# Altium schematic sheet Copy of -5V Buck and Power Jack.SchDoc
size A; SheetNumber: 3; SheetTotal: 7
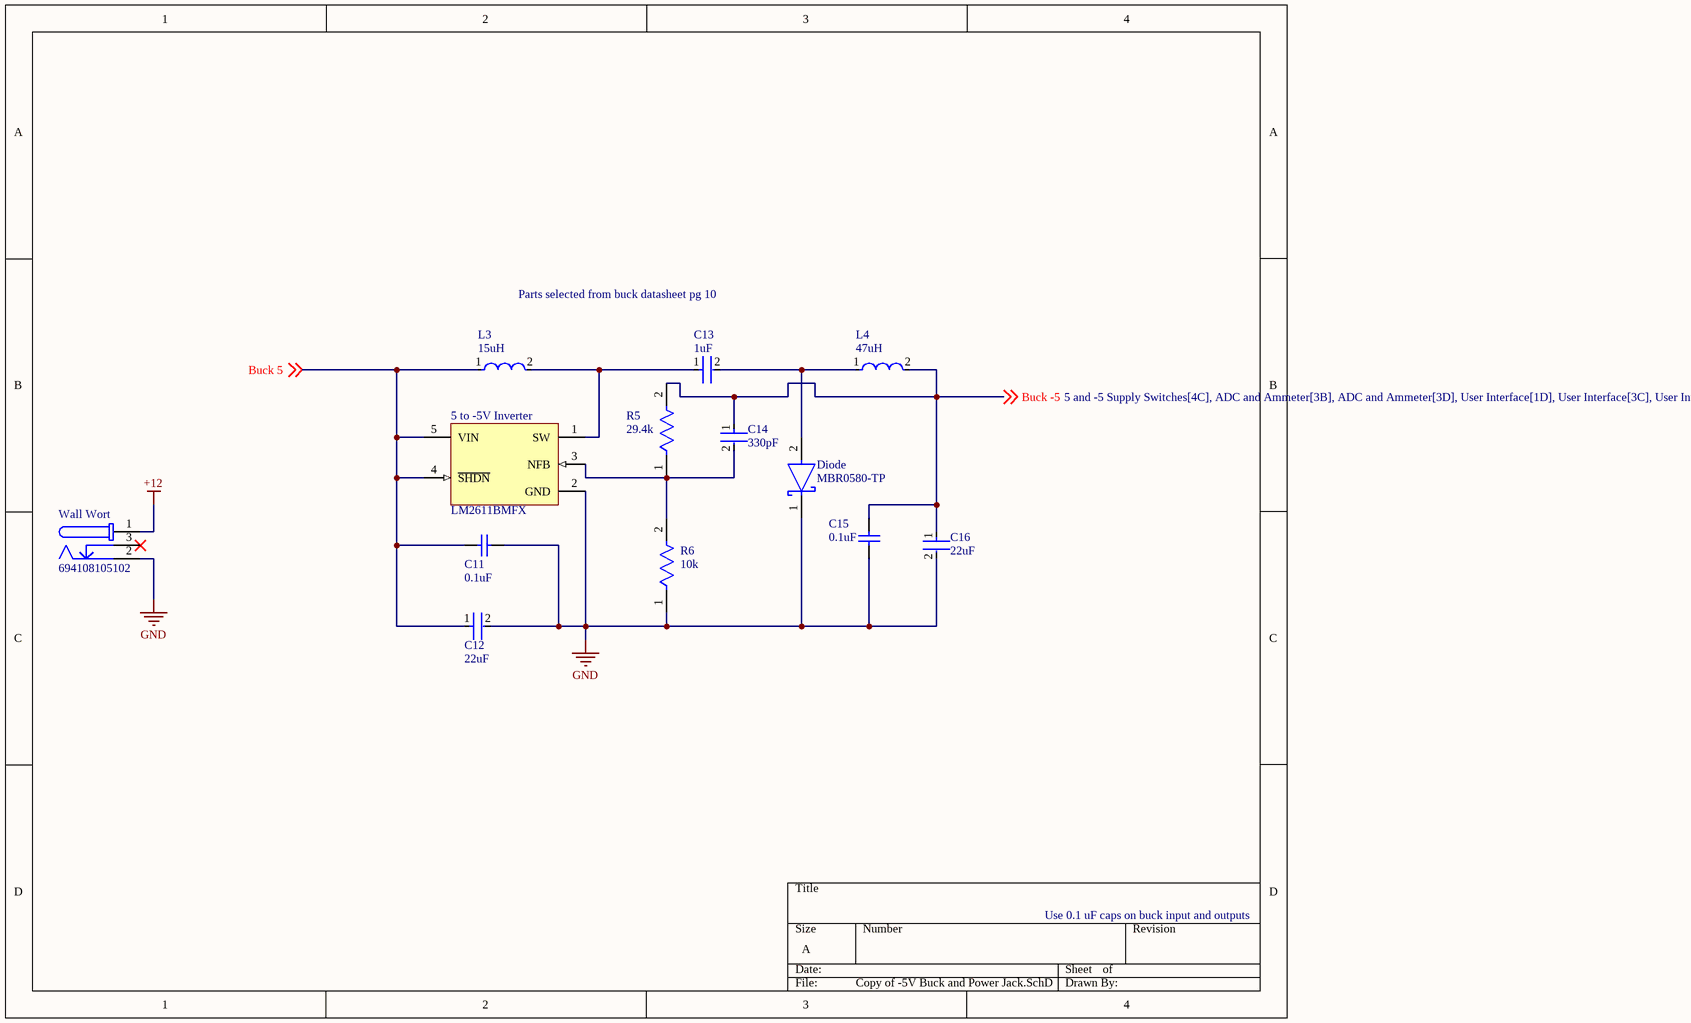
[diagram p0: Copy of -5V Buck and Power Jack.SchDoc]

## Parts
5_to_-5V_Inverter  LM2611BMFX  [MF05A_N]
C11  0.1uF  [CAPC2013X94X50LL20T25]
C12  22uF  [FP-CL21-IPC_C]
C13  1uF  [FP-CL10-IPC_B]
C14  330pF  [FP-C0603C-CF-MFG]
C15  0.1uF  [CAPC2013X94X50LL20T25]
C16  22uF  [FP-CL21-IPC_C]
Diode  MBR0580-TP  [FP-SOD-123-IPC_C]
L3  15uH  [FP-SRR1260-MFG]
L4  47uH  [FP-SRP1265A-MFG]
R5  29.4k  [FP-AC0603-MFG]
R6  10k  [FP-RK73H1J-IPC_B]
Wall_Wort  694108105102  [694108105102]

## Nets
+12: Wall_Wort.1
GND: 5_to_-5V_Inverter.2(GND) C11.2 C12.2 C15.1 C16.2 Diode.1(C) R6.1 Wall_Wort.2
Buck 5: 5_to_-5V_Inverter.4(~{SHDN}) 5_to_-5V_Inverter.5(VIN) C11.1 C12.1 L3.1 ; off-sheet Buck 5
Buck -5: C14.1 C15.2 C16.1 L4.2 R5.2 ; off-sheet Buck -5
Net5_to_-5V_Inverter_1: 5_to_-5V_Inverter.1(SW) C13.1 L3.2
Net5_to_-5V_Inverter_3: 5_to_-5V_Inverter.3(NFB) C14.2 R5.1 R6.2
NetC13_2: C13.2 Diode.2(A) L4.1

Not connected (* = marked no-connect by the designer): Wall_Wort 3*

## Notes on the sheet
- Parts selected from buck datasheet pg 10
- Use 0.1 uF caps on buck input and outputs

## Library data of the parts
5_to_-5V_Inverter = CMP-0069-01170-2: 1.4MHz Cuk Converter, 5-pin SOT-23; Manufacturer: National Semiconductor; PowerWise: N; CompType: Switcher; PackageTopMarking: S40B*XTT; DatasheetVersion: Jan-2005; PackageDescription: Molded SOT-23, .115 x .063 x .040 in Body, 5 Lead, .0375 in Pitch; PackageReference: MF05A; ComponentLink2Description: LM2611 Web Page; ComponentLink1Description: LM2611 Datasheet; ComponentLink1URL: http://www.national.com/ds/LM/LM2611.pdf; PackageVersion: revD, Aug-2008; RevisionNote: Component URLs added; RoHS: N; ComponentLink3URL: http://www.national.com/packaging/folders/mf05a.html; PinCount: 5; ComponentLink3Description: MF05A Package Page; ComponentLink2URL: http://www.national.com/pf/LM/LM2611.html
C11 C15 = CMP-2007-04368-1: Part Number: 08055C104JAT4A; Manufacturer: AVX Interconnect / Elco
C12 C16 = CMP-13271-003225-1: CL21 Series 0805 22uF 25V ±20% Tolerance X5R Multilayer Ceramic Chip Capacitor
C13 = CMP-13271-001078-1: Cap Ceramic 1uF 25V X5R ±10% Pad SMD 0603 +85°C T/R; Tolerance: 10%; Voltage Rating (DC): 25V; Case/Package: 0603; Capacitance: 1uF; Dielectric: X5R
C14 = CMP-03020-015589-1: C0603 330 pF X8R 30ppm/°C 20.00% 50 V; Manufacturer: KEMET; Manufacturer Part Number: C0603C331M5HACTU; Tolerance: 0.2; Voltage Rating: 50 V; Automotive Grade: Grade 1; Material: Ceramic; Temperature Coefficient: 30ppm/°C; Value: 330 pF; ComponentLink2URL: https://api.kemet.com/component-edge/download/datasheet/C0603C100J5GACAUTO.pdf; Package: C0603C-CF; ComponentLink2Description: Datasheet; Device Class L2: Capacitors; Device Class L3: Ceramic Capacitors; Height: 0.87mm; Category: Cap; Temperature Characteristic: X8R; Temperature: -55°C to +125°C; Automotive: Yes; RoHS: TRUE; Capacitance: 330 pF; Temperature Range High: +125°C; Lead Free: Yes; Temperature Range Low: -55°C; Device Class L1: Passive Components; Octopart: https://octopart.com/c0603c331m5hactu-kemet-88725658
Diode = CMP-56206-000006-1: DIODE SCHOTTKY 80V 500MA SOD123; Max Power Dissipation: 410mW; Max Reverse Leakage Current: 200uA; Max Surge Current: 5.5A; Forward Voltage: 800mV; Min Operating Temperature: -55°C; Packaging: Tape and Reel; Max Operating Temperature: 150°C; Lead Free: Lead Free; Peak Reverse Current: 200uA; Mount: Surface Mount; Max Reverse Voltage (DC): 80V; Package Quantity: 1; Max Repetitive Reverse Voltage (Vrrm): 80V; Average Rectified Current: 500mA
L3 = CMP-2000-07146-2: FIXED IND 15UH 5A 27 MOHM SMD; Q Factor: 25; Sample Rate (Hz): 100kHz; Resistance: 27MR; Material: Steel; Inductance Tolerance: 20%; Frequency: 17.6MHz; Saturation Current: 4.6A; Core Material: Ferrite; Shielding: Shielded; Series: SRR1260; Termination: SMD/SMT; Packaging: Tape and Reel; RoHS Compliant: Yes; Height - Seated (Max): 0.256inch; Depth: 12.8mm; Case/Package: 1260; Inductance: 15uH; Height: 6mm; Number of Pins: 2; Mount: Surface Mount; Min Operating Temperature: -40°C; Test Frequency: 100kHz; Length: 12.5mm; Self Resonant Frequency: 17.6MHz; Current Rating: 5A; Tolerance: 20%; RMS Current (Irms): 5A; REACH SVHC: No SVHC; Resistor Type: Wirewound; DC Resistance (DCR): 27mR; Width: 12.5mm; Package Quantity: 600; DC Current: 5A; Max DC Current: 5A; Max Operating Temperature: 125°C; Military Standard: Not
L4 = CMP-07248-000075-1: FIXED IND 47UH 6.5A 90 MOHM SMD; Shielding: Shielded; DC Resistance (DCR): 90mR; Tolerance: 20%; Core Material: Ferrite; Self Resonant Frequency: 4MHz; Q Factor: 20; Test Frequency: 100kHz; Saturation Current: 9.5A; Min Operating Temperature: -40°C; Termination: SMD/SMT; Current Rating: 6.5A; Mount: Surface Mount; RoHS Compliant: Yes; Max DC Current: 6.5A; Resistor Type: Wirewound; Height: 6.2mm; Height - Seated (Max): 0.252inch; Packaging: Tape and Reel; Ratings: AEC-Q200; Inductance: 47uH; Inductance Tolerance: 20%; Width: 12.5mm; Max Operating Temperature: 150°C; Package Quantity: 500; RMS Current (Irms): 6.5A; Case/Package: Nonstandard; Length: 13.5mm; REACH SVHC: No SVHC; Depth: 12.5mm
R5 = CMP-03412-019541-2: RES 29.4KΩ 1.00% 0.1W 0603; Max Power Dissipation: 100mW; Tolerance: 1%; Temperature Coefficient: 100ppm/°C; Resistance: 29.4kR; Length: 0.063inch; Height: 0.022inch; Max Operating Temperature: 155°C; Number of Terminations: 2; Min Operating Temperature: -55°C; Resistor Type: Thick Film; Packaging: Tape and Reel; Width: 0.031inch; Series: AC; RoHS Compliant: Yes; Case/Package: 0603; Features: Moisture Resistant
R6 = CMP-2000-01751-2: 10kΩ ±1% 0.1W Chip Resistor 0603 Thick Film AEC-Q200 Qualified; Power Rating: 100mW; Temperature Coefficient: 100ppm/°C; Resistance: 10kR; Voltage Rating: 50V; Construction: Rectangular; Max Operating Temperature: 155°C; Resistor Type: Thick Film; Case/Package: 0603; Military Standard: MIL-R-55342F; Depth: 0.8mm; Termination: SMD/SMT; Min Operating Temperature: -55°C; RoHS Compliant: Yes; Width: 0.8mm; Length: 1.6mm; Height: 0.45mm; Case Code (Metric): 1608; Package Quantity: 10000; Lead Free: Lead Free; Series: RK73H; Packaging: Tape and Reel; Case Code (Imperial): 0603; Tolerance: 1%
Wall_Wort = CMP-1502-00179-2: NexarPartId: 52645185; Gender: Male; Current Rating: 5A; Connector Type: Power; Insulation Resistance: 100MΩ; Operating Supply Voltage: 24V; Shielding: Unshielded; Contact Plating: Tin; Flammability Rating: UL94 V-0; Mount: Surface Mount; REACH SVHC: Unknown; Termination: SMD/SMT; RoHS: Compliant; Packaging: Tape and Reel; Min Operating Temperature: -40°C; Contact Gender: Female; Voltage Rating (DC): 24V; Voltage Rating: 24V; Color: Black; Max Operating Temperature: 85°C; Housing Material: Polyamide